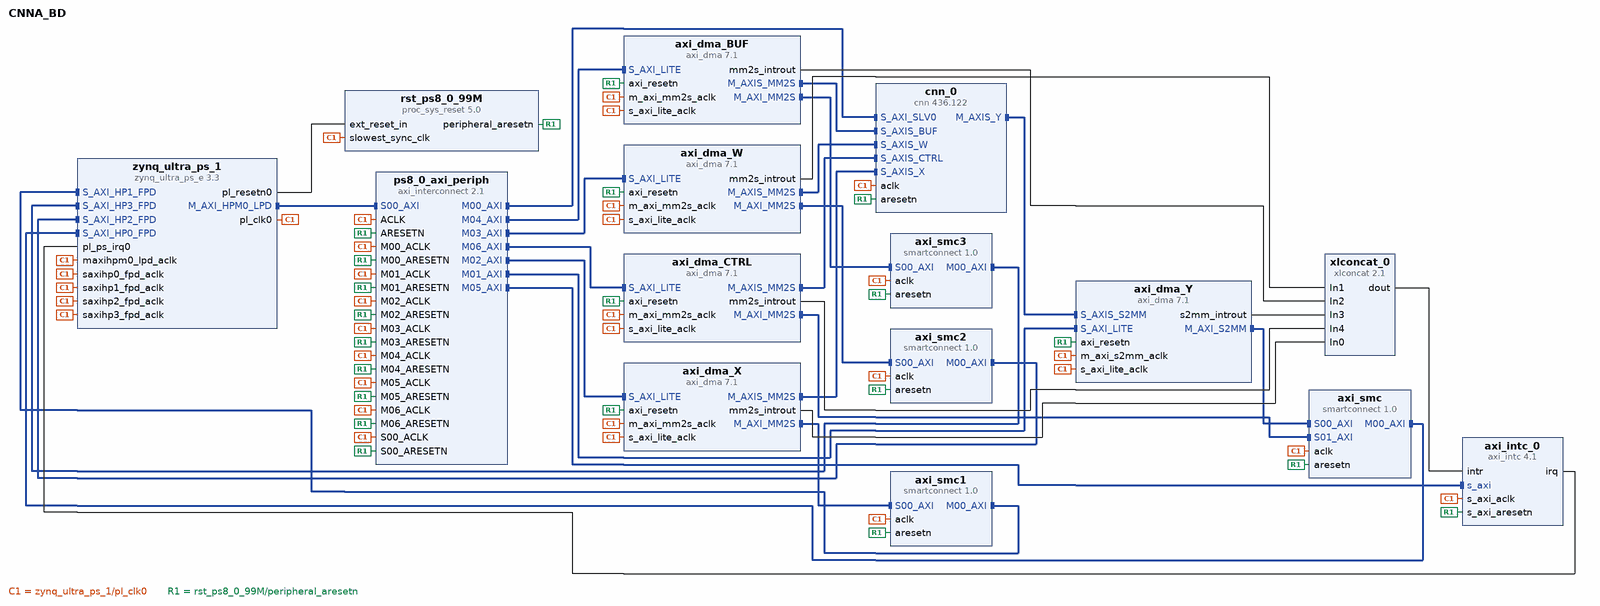
[diagram p0: block diagram of the top level]
# Vivado block design CNNA_BD, xczu3eg-sbva484-1-e, Vivado 2019.1
create_bd_design CNNA_BD

create_bd_cell -type ip -vlnv xilinx.com:ip:axi_interconnect:2.1 ps8_0_axi_periph
set_property -dict {CONFIG.NUM_MI 7} [get_bd_cells ps8_0_axi_periph]
create_bd_cell -type ip -vlnv xilinx.com:ip:proc_sys_reset:5.0 rst_ps8_0_99M
create_bd_cell -type ip -vlnv xilinx.com:ip:axi_dma:7.1 axi_dma_Y
set_property -dict [list \
  CONFIG.c_include_mm2s 0 \
  CONFIG.c_include_s2mm_dre 1 \
  CONFIG.c_include_sg 0 \
  CONFIG.c_s2mm_burst_size 256 \
  CONFIG.c_sg_length_width 26 \
] [get_bd_cells axi_dma_Y]
create_bd_cell -type ip -vlnv xilinx.com:ip:smartconnect:1.0 axi_smc
set_property -dict {CONFIG.NUM_MI 1 CONFIG.NUM_SI 2} [get_bd_cells axi_smc]
create_bd_cell -type ip -vlnv xilinx.com:ip:axi_dma:7.1 axi_dma_X
set_property -dict [list \
  CONFIG.c_include_mm2s 1 \
  CONFIG.c_include_mm2s_dre 1 \
  CONFIG.c_include_s2mm 0 \
  CONFIG.c_include_sg 0 \
  CONFIG.c_m_axi_mm2s_data_width 128 \
  CONFIG.c_m_axis_mm2s_tdata_width 128 \
  CONFIG.c_mm2s_burst_size 256 \
  CONFIG.c_sg_length_width 26 \
] [get_bd_cells axi_dma_X]
create_bd_cell -type ip -vlnv xilinx.com:ip:smartconnect:1.0 axi_smc1
set_property -dict {CONFIG.NUM_SI 1} [get_bd_cells axi_smc1]
create_bd_cell -type ip -vlnv xilinx.com:ip:axi_dma:7.1 axi_dma_W
set_property -dict [list \
  CONFIG.c_include_mm2s 1 \
  CONFIG.c_include_mm2s_dre 1 \
  CONFIG.c_include_s2mm 0 \
  CONFIG.c_include_sg 0 \
  CONFIG.c_m_axi_mm2s_data_width 128 \
  CONFIG.c_m_axis_mm2s_tdata_width 128 \
  CONFIG.c_mm2s_burst_size 256 \
  CONFIG.c_sg_length_width 26 \
] [get_bd_cells axi_dma_W]
create_bd_cell -type ip -vlnv xilinx.com:ip:smartconnect:1.0 axi_smc2
set_property -dict {CONFIG.NUM_SI 1} [get_bd_cells axi_smc2]
create_bd_cell -type ip -vlnv xilinx.com:ip:axi_dma:7.1 axi_dma_BUF
set_property -dict [list \
  CONFIG.c_include_mm2s 1 \
  CONFIG.c_include_mm2s_dre 1 \
  CONFIG.c_include_s2mm 0 \
  CONFIG.c_include_sg 0 \
  CONFIG.c_m_axi_mm2s_data_width 128 \
  CONFIG.c_m_axis_mm2s_tdata_width 128 \
  CONFIG.c_mm2s_burst_size 256 \
  CONFIG.c_sg_length_width 26 \
] [get_bd_cells axi_dma_BUF]
create_bd_cell -type ip -vlnv xilinx.com:ip:smartconnect:1.0 axi_smc3
set_property -dict {CONFIG.NUM_SI 1} [get_bd_cells axi_smc3]
create_bd_cell -type ip -vlnv xilinx.com:ip:zynq_ultra_ps_e:3.3 zynq_ultra_ps_1
set_property -dict [list \
  CONFIG.PSU__CRL_APB__PL0_REF_CTRL__FREQMHZ 180 \
  CONFIG.PSU__DDR_HIGH_ADDRESS_GUI_ENABLE 0 \
  CONFIG.PSU__USE__IRQ0 1 \
  CONFIG.PSU__USE__S_AXI_GP2 1 \
  CONFIG.PSU__USE__S_AXI_GP3 1 \
  CONFIG.PSU__USE__S_AXI_GP4 1 \
  CONFIG.PSU__USE__S_AXI_GP5 1 \
] [get_bd_cells zynq_ultra_ps_1]
# 30 more settings of zynq_ultra_ps_1 are not shown: defaults, MIO pin electricals, DDR timing, and values the tool derives
create_bd_cell -type ip -vlnv xilinx.com:ip:axi_intc:4.1 axi_intc_0
create_bd_cell -type ip -vlnv xilinx.com:ip:xlconcat:2.1 xlconcat_0
set_property -dict {CONFIG.NUM_PORTS 5} [get_bd_cells xlconcat_0]
create_bd_cell -type ip -vlnv xilinx.com:ip:axi_dma:7.1 axi_dma_CTRL
set_property -dict [list \
  CONFIG.c_include_mm2s 1 \
  CONFIG.c_include_mm2s_dre 1 \
  CONFIG.c_include_s2mm 0 \
  CONFIG.c_include_sg 0 \
  CONFIG.c_m_axi_mm2s_data_width 64 \
  CONFIG.c_m_axis_mm2s_tdata_width 64 \
  CONFIG.c_mm2s_burst_size 16 \
  CONFIG.c_sg_length_width 21 \
] [get_bd_cells axi_dma_CTRL]
create_bd_cell -type ip -vlnv xilinx.com:hls:cnn:436.122 cnn_0
set_property -dict {CONFIG.C_S_AXI_SLV0_ADDR_WIDTH 8} [get_bd_cells cnn_0]

# ---- connections ----

connect_bd_intf_net [get_bd_intf_pins axi_dma_X/M_AXIS_MM2S] [get_bd_intf_pins cnn_0/S_AXIS_X]
connect_bd_intf_net [get_bd_intf_pins cnn_0/M_AXIS_Y] [get_bd_intf_pins axi_dma_Y/S_AXIS_S2MM]
connect_bd_intf_net [get_bd_intf_pins axi_smc1/M00_AXI] [get_bd_intf_pins zynq_ultra_ps_1/S_AXI_HP1_FPD]
connect_bd_intf_net [get_bd_intf_pins ps8_0_axi_periph/M06_AXI] [get_bd_intf_pins axi_dma_CTRL/S_AXI_LITE]
connect_bd_intf_net -intf_net axi_dma_0_M_AXI_MM2S [get_bd_intf_pins axi_dma_CTRL/M_AXI_MM2S] [get_bd_intf_pins axi_smc/S01_AXI]
connect_bd_intf_net -intf_net axi_dma_0_M_AXIS_MM2S [get_bd_intf_pins axi_dma_CTRL/M_AXIS_MM2S] [get_bd_intf_pins cnn_0/S_AXIS_CTRL]
connect_bd_intf_net -intf_net axi_dma_0_M_AXI_S2MM [get_bd_intf_pins axi_dma_Y/M_AXI_S2MM] [get_bd_intf_pins axi_smc/S00_AXI]
connect_bd_intf_net [get_bd_intf_pins ps8_0_axi_periph/M05_AXI] [get_bd_intf_pins axi_intc_0/s_axi]
connect_bd_intf_net [get_bd_intf_pins axi_dma_W/M_AXIS_MM2S] [get_bd_intf_pins cnn_0/S_AXIS_W]
connect_bd_intf_net [get_bd_intf_pins axi_dma_BUF/M_AXIS_MM2S] [get_bd_intf_pins cnn_0/S_AXIS_BUF]
connect_bd_intf_net [get_bd_intf_pins axi_dma_BUF/M_AXI_MM2S] [get_bd_intf_pins axi_smc3/S00_AXI]
connect_bd_intf_net [get_bd_intf_pins ps8_0_axi_periph/M00_AXI] [get_bd_intf_pins cnn_0/S_AXI_SLV0]
connect_bd_intf_net [get_bd_intf_pins axi_smc/M00_AXI] [get_bd_intf_pins zynq_ultra_ps_1/S_AXI_HP0_FPD]
connect_bd_intf_net [get_bd_intf_pins zynq_ultra_ps_1/S_AXI_HP3_FPD] [get_bd_intf_pins axi_smc3/M00_AXI]
connect_bd_intf_net [get_bd_intf_pins ps8_0_axi_periph/M02_AXI] [get_bd_intf_pins axi_dma_X/S_AXI_LITE]
connect_bd_intf_net [get_bd_intf_pins zynq_ultra_ps_1/M_AXI_HPM0_LPD] [get_bd_intf_pins ps8_0_axi_periph/S00_AXI]
connect_bd_intf_net [get_bd_intf_pins axi_dma_W/M_AXI_MM2S] [get_bd_intf_pins axi_smc2/S00_AXI]
connect_bd_intf_net [get_bd_intf_pins ps8_0_axi_periph/M04_AXI] [get_bd_intf_pins axi_dma_BUF/S_AXI_LITE]
connect_bd_intf_net [get_bd_intf_pins ps8_0_axi_periph/M01_AXI] [get_bd_intf_pins axi_dma_Y/S_AXI_LITE]
connect_bd_intf_net [get_bd_intf_pins axi_smc2/M00_AXI] [get_bd_intf_pins zynq_ultra_ps_1/S_AXI_HP2_FPD]
connect_bd_intf_net [get_bd_intf_pins axi_dma_X/M_AXI_MM2S] [get_bd_intf_pins axi_smc1/S00_AXI]
connect_bd_intf_net [get_bd_intf_pins ps8_0_axi_periph/M03_AXI] [get_bd_intf_pins axi_dma_W/S_AXI_LITE]
connect_bd_net -net zynq_ultra_ps_e_0_pl_clk0 [get_bd_pins zynq_ultra_ps_1/pl_clk0] \
  [get_bd_pins ps8_0_axi_periph/S00_ACLK] [get_bd_pins rst_ps8_0_99M/slowest_sync_clk] \
  [get_bd_pins ps8_0_axi_periph/M00_ACLK] [get_bd_pins ps8_0_axi_periph/ACLK] [get_bd_pins axi_dma_Y/m_axi_s2mm_aclk] \
  [get_bd_pins axi_smc/aclk] [get_bd_pins axi_dma_Y/s_axi_lite_aclk] [get_bd_pins ps8_0_axi_periph/M01_ACLK] \
  [get_bd_pins axi_smc1/aclk] [get_bd_pins axi_dma_X/s_axi_lite_aclk] [get_bd_pins ps8_0_axi_periph/M02_ACLK] \
  [get_bd_pins axi_dma_X/m_axi_mm2s_aclk] [get_bd_pins axi_smc2/aclk] [get_bd_pins axi_smc3/aclk] \
  [get_bd_pins axi_dma_W/s_axi_lite_aclk] [get_bd_pins ps8_0_axi_periph/M03_ACLK] [get_bd_pins axi_dma_W/m_axi_mm2s_aclk] \
  [get_bd_pins axi_dma_BUF/s_axi_lite_aclk] [get_bd_pins ps8_0_axi_periph/M04_ACLK] [get_bd_pins axi_dma_BUF/m_axi_mm2s_aclk] \
  [get_bd_pins zynq_ultra_ps_1/maxihpm0_lpd_aclk] [get_bd_pins zynq_ultra_ps_1/saxihp0_fpd_aclk] \
  [get_bd_pins zynq_ultra_ps_1/saxihp1_fpd_aclk] [get_bd_pins zynq_ultra_ps_1/saxihp2_fpd_aclk] \
  [get_bd_pins zynq_ultra_ps_1/saxihp3_fpd_aclk] [get_bd_pins axi_intc_0/s_axi_aclk] [get_bd_pins ps8_0_axi_periph/M05_ACLK] \
  [get_bd_pins axi_dma_CTRL/s_axi_lite_aclk] [get_bd_pins ps8_0_axi_periph/M06_ACLK] \
  [get_bd_pins axi_dma_CTRL/m_axi_mm2s_aclk] [get_bd_pins cnn_0/aclk]
connect_bd_net [get_bd_pins rst_ps8_0_99M/peripheral_aresetn] \
  [get_bd_pins ps8_0_axi_periph/S00_ARESETN] [get_bd_pins ps8_0_axi_periph/M00_ARESETN] \
  [get_bd_pins ps8_0_axi_periph/ARESETN] [get_bd_pins axi_smc/aresetn] [get_bd_pins axi_dma_Y/axi_resetn] \
  [get_bd_pins ps8_0_axi_periph/M01_ARESETN] [get_bd_pins axi_dma_X/axi_resetn] [get_bd_pins ps8_0_axi_periph/M02_ARESETN] \
  [get_bd_pins axi_smc1/aresetn] [get_bd_pins axi_smc2/aresetn] [get_bd_pins axi_dma_W/axi_resetn] \
  [get_bd_pins ps8_0_axi_periph/M03_ARESETN] [get_bd_pins axi_dma_BUF/axi_resetn] [get_bd_pins ps8_0_axi_periph/M04_ARESETN] \
  [get_bd_pins axi_smc3/aresetn] [get_bd_pins axi_intc_0/s_axi_aresetn] [get_bd_pins ps8_0_axi_periph/M05_ARESETN] \
  [get_bd_pins axi_dma_CTRL/axi_resetn] [get_bd_pins ps8_0_axi_periph/M06_ARESETN] [get_bd_pins cnn_0/aresetn]
connect_bd_net [get_bd_pins zynq_ultra_ps_1/pl_resetn0] [get_bd_pins rst_ps8_0_99M/ext_reset_in]
connect_bd_net [get_bd_pins axi_dma_X/mm2s_introut] [get_bd_pins xlconcat_0/In0]
connect_bd_net [get_bd_pins axi_dma_W/mm2s_introut] [get_bd_pins xlconcat_0/In1]
connect_bd_net [get_bd_pins axi_dma_BUF/mm2s_introut] [get_bd_pins xlconcat_0/In2]
connect_bd_net [get_bd_pins axi_dma_Y/s2mm_introut] [get_bd_pins xlconcat_0/In3]
connect_bd_net [get_bd_pins xlconcat_0/dout] [get_bd_pins axi_intc_0/intr]
connect_bd_net [get_bd_pins axi_intc_0/irq] [get_bd_pins zynq_ultra_ps_1/pl_ps_irq0]
connect_bd_net -net axi_dma_0_mm2s_introut [get_bd_pins axi_dma_CTRL/mm2s_introut] [get_bd_pins xlconcat_0/In4]

# ---- address map ----
assign_bd_address -offset 0x00000000 -range 2G -target_address_space [get_bd_addr_spaces axi_dma_BUF/Data_MM2S] [get_bd_addr_segs zynq_ultra_ps_1/SAXIGP5/HP3_DDR_LOW]
exclude_bd_addr_seg -offset 0xFF000000 -range 16M -target_address_space [get_bd_addr_spaces axi_dma_BUF/Data_MM2S] [get_bd_addr_segs zynq_ultra_ps_1/SAXIGP5/HP3_LPS_OCM]
assign_bd_address -offset 0x00000000 -range 2G -target_address_space [get_bd_addr_spaces axi_dma_CTRL/Data_MM2S] [get_bd_addr_segs zynq_ultra_ps_1/SAXIGP2/HP0_DDR_LOW]
exclude_bd_addr_seg -offset 0xFF000000 -range 16M -target_address_space [get_bd_addr_spaces axi_dma_CTRL/Data_MM2S] [get_bd_addr_segs zynq_ultra_ps_1/SAXIGP2/HP0_LPS_OCM]
assign_bd_address -offset 0x00000000 -range 2G -target_address_space [get_bd_addr_spaces axi_dma_W/Data_MM2S] [get_bd_addr_segs zynq_ultra_ps_1/SAXIGP4/HP2_DDR_LOW]
exclude_bd_addr_seg -offset 0xFF000000 -range 16M -target_address_space [get_bd_addr_spaces axi_dma_W/Data_MM2S] [get_bd_addr_segs zynq_ultra_ps_1/SAXIGP4/HP2_LPS_OCM]
assign_bd_address -offset 0x00000000 -range 2G -target_address_space [get_bd_addr_spaces axi_dma_X/Data_MM2S] [get_bd_addr_segs zynq_ultra_ps_1/SAXIGP3/HP1_DDR_LOW]
exclude_bd_addr_seg -offset 0xFF000000 -range 16M -target_address_space [get_bd_addr_spaces axi_dma_X/Data_MM2S] [get_bd_addr_segs zynq_ultra_ps_1/SAXIGP3/HP1_LPS_OCM]
assign_bd_address -offset 0x00000000 -range 2G -target_address_space [get_bd_addr_spaces axi_dma_Y/Data_S2MM] [get_bd_addr_segs zynq_ultra_ps_1/SAXIGP2/HP0_DDR_LOW]
exclude_bd_addr_seg -offset 0xFF000000 -range 16M -target_address_space [get_bd_addr_spaces axi_dma_Y/Data_S2MM] [get_bd_addr_segs zynq_ultra_ps_1/SAXIGP2/HP0_LPS_OCM]
assign_bd_address -offset 0x0080000000 -range 4K -target_address_space [get_bd_addr_spaces zynq_ultra_ps_1/Data] [get_bd_addr_segs axi_dma_BUF/S_AXI_LITE/Reg]
assign_bd_address -offset 0x0080001000 -range 4K -target_address_space [get_bd_addr_spaces zynq_ultra_ps_1/Data] [get_bd_addr_segs axi_dma_W/S_AXI_LITE/Reg]
assign_bd_address -offset 0x0080002000 -range 4K -target_address_space [get_bd_addr_spaces zynq_ultra_ps_1/Data] [get_bd_addr_segs axi_dma_X/S_AXI_LITE/Reg]
assign_bd_address -offset 0x0080003000 -range 4K -target_address_space [get_bd_addr_spaces zynq_ultra_ps_1/Data] [get_bd_addr_segs axi_dma_Y/S_AXI_LITE/Reg]
assign_bd_address -offset 0x0080004000 -range 4K -target_address_space [get_bd_addr_spaces zynq_ultra_ps_1/Data] [get_bd_addr_segs axi_intc_0/S_AXI/Reg]
assign_bd_address -offset 0x0080005000 -range 4K -target_address_space [get_bd_addr_spaces zynq_ultra_ps_1/Data] [get_bd_addr_segs axi_dma_CTRL/S_AXI_LITE/Reg]
assign_bd_address -offset 0x0080010000 -range 64K -target_address_space [get_bd_addr_spaces zynq_ultra_ps_1/Data] [get_bd_addr_segs cnn_0/S_AXI_SLV0/Reg]

validate_bd_design
save_bd_design
